# Altium schematic sheet LP_ECG_Power-X01.SchDoc: DB POWER (part 3 of 3)
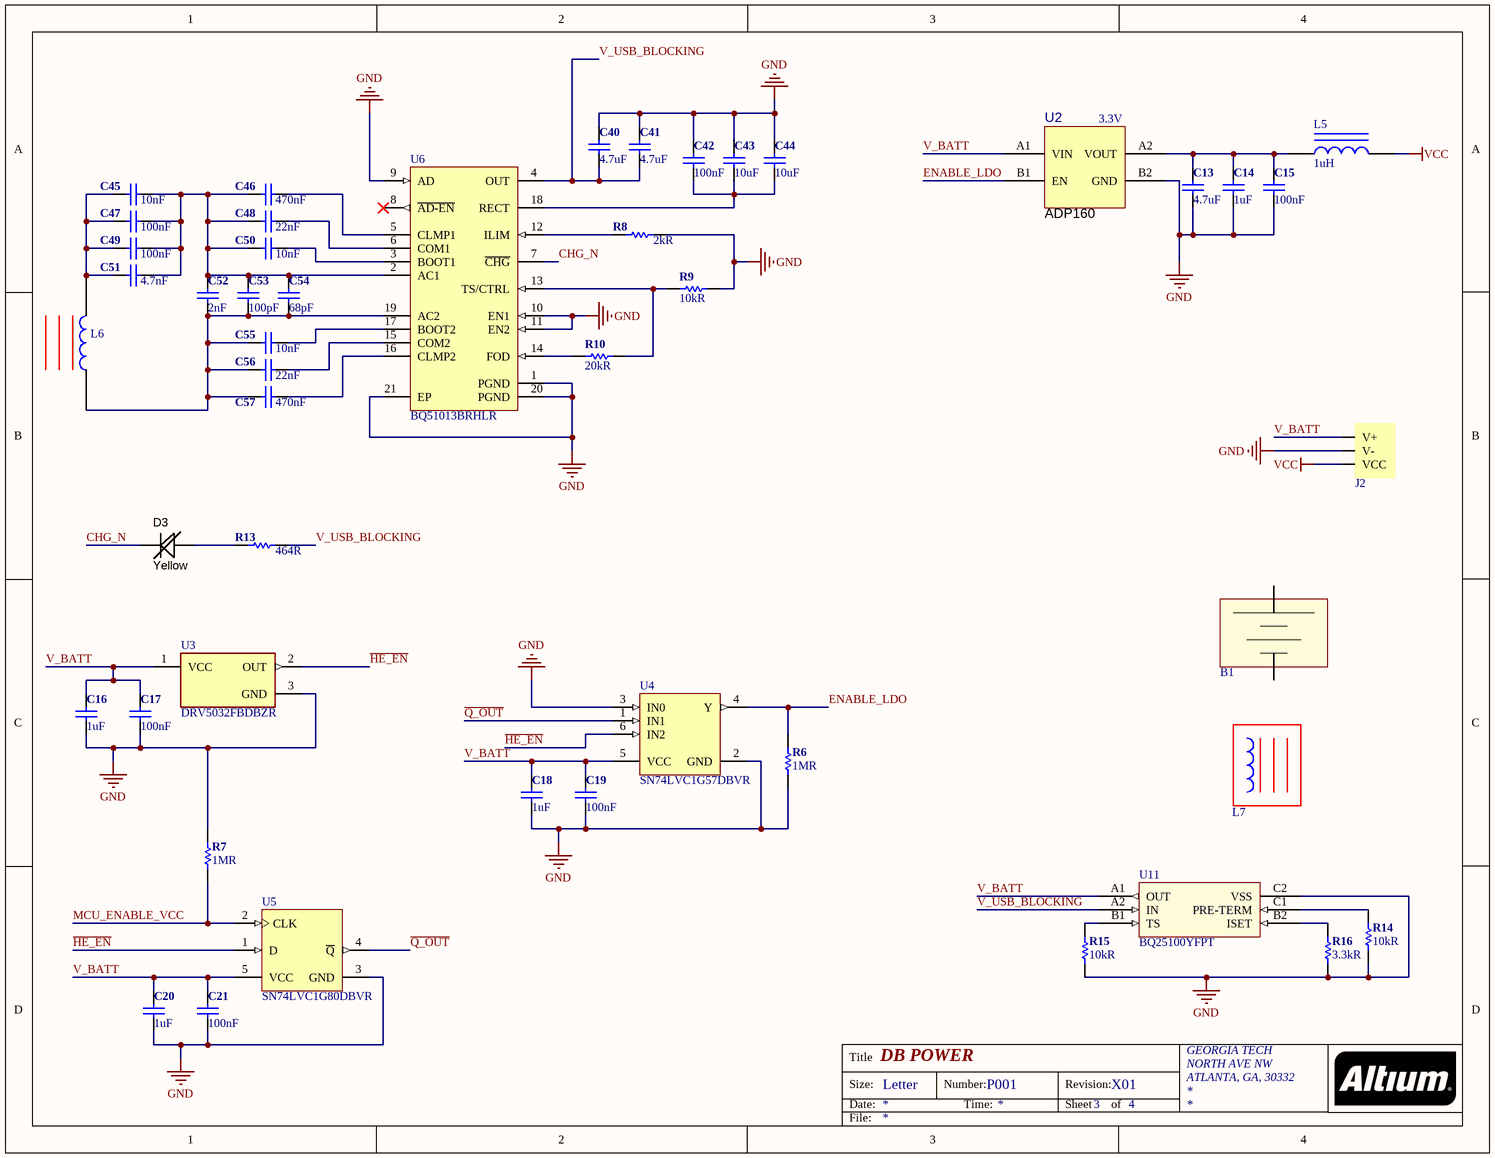
[diagram p2: LP_ECG_Power-X01.SchDoc]

## Library data of the parts (continued)
U4 = CMP-0859-00228-3: CONFIGURABLE MULTIPLE-FUNCTION GATE, DBV0006A, LARGE T&R; Manufacturer: Texas Instruments; Number of Inputs: 3; Min Supply Voltage: 1.65V; Max Supply Voltage: 5.5V; Propagation Delay: 6.3ns; Logic Function: NAND GATE,AND GATE,NOR GATE,OR GATE,Inverter,Multi Function; Number of Circuits: 1; High Level Output Current: -32mA; Low Level Output Current: 32mA; Number of Input Lines: 2; Quiescent Current: 10uA; Schmitt Trigger Input: Yes; Turn-On Delay Time: 6.1ns; Supplier 1: Digi-Key; Supplier Part Number 1: 296-15574-1-ND; Manufacturer Part Number: SN74LVC1G57DBVR; RoHS: Yes; Category: Logic Gates; Stock 1: 11185; Pricing 1: 1=0.37000, 10=0.28100, 25=0.25320, 100=0.17480, 250=0.14720, 500=0.11960, 1000=0.09200 (USD); Mount: Surface Mount; Case/Package: SOT-23; Number of Pins: 6; Weight: 0.000229oz; Contact Plating: Gold; Min Operating Temperature: -40°C; Max Operating Temperature: 125°C; Package Quantity: 3000; Packaging: Tape and Reel; Number of Gates: 1; Number of Output Lines: 1; Number of Elements: 1; Number of Bits: 1; Output Current: 32mA; Number of Outputs: 1; Max Output Current: 32mA; Termination: SMD/SMT; Length: 3.05mm; Height: 1.3mm; Width: 1.75mm; Radiation Hardening: No; Lead Free: Lead Free; REACH SVHC: No SVHC; ComponentLink1URL: https://www.ti.com:443/lit/ds/symlink/sn74lvc1g57.pdf?src-supplier=IHS+Markit; ComponentLink1Description: https://www.ti.com:443/lit/ds/symlink/sn74lvc1g57.pdf?src-supplier=IHS+Markit; ComponentLink2URL: https://datasheet.ciiva.com/15090/getdatasheetpartid-173082-15090973.pdf?src-supplier=Verical; ComponentLink2Description: https://datasheet.ciiva.com/15090/getdatasheetpartid-173082-15090973.pdf?src-supplier=Verical; ComponentLink3URL: https://datasheet.ciiva.com/1880/sn74lvc1g57-1880083.pdf?src-supplier=Digi-Key; ComponentLink3Description: https://datasheet.ciiva.com/1880/sn74lvc1g57-1880083.pdf?src-supplier=Digi-Key; ComponentLink4URL: https://datasheet.ciiva.com/1880/sn74lvc1g57-1880084.pdf?src-supplier=Digi-Key; ComponentLink4Description: https://datasheet.ciiva.com/1880/sn74lvc1g57-1880084.pdf?src-supplier=Digi-Key; ComponentLink5URL: https://datasheet.ciiva.com/46395/1882763-46395382.pdf?src-supplier=Element14; ComponentLink5Description: https://datasheet.ciiva.com/46395/1882763-46395382.pdf?src-supplier=Element14; ComponentLink6URL: https://datasheet.ciiva.com/46439/1834192-46439175.pdf?src-supplier=Element14; ComponentLink6Description: https://datasheet.ciiva.com/46439/1834192-46439175.pdf?src-supplier=Element14; ComponentLink7URL: https://datasheet.ciiva.com/7783/1771418-7783483.pdf?src-supplier=Element14; ComponentLink7Description: https://datasheet.ciiva.com/7783/1771418-7783483.pdf?src-supplier=Element14; ComponentLink8URL: https://datasheet.ciiva.com/7783/1771418-7783484.pdf?src-supplier=Element14; ComponentLink8Description: https://datasheet.ciiva.com/7783/1771418-7783484.pdf?src-supplier=Element14; ComponentLink9URL: https://datasheet.ciiva.com/1880/sn74lvc1g57-1880082.pdf?src-supplier=Digi-Key; ComponentLink9Description: https://datasheet.ciiva.com/1880/sn74lvc1g57-1880082.pdf?src-supplier=Digi-Key; ComponentLink10URL: https://datasheet.ciiva.com/48702/001075107-da-01-en-ic-mult-fun-sn74lvc1g57dbvr-sot-23-6-tid-48702374.pdf?src-supplier=Conrad; ComponentLink10Description: https://datasheet.ciiva.com/48702/001075107-da-01-en-ic-mult-fun-sn74lvc1g57dbvr-sot-23-6-tid-48702374.pdf?src-supplier=Conrad
U5 = CMP-0859-00176-3: Single Positive-Edge-Triggered D-Type Flip-Flop, DBV0005A, LARGE T&R; Manufacturer: Texas Instruments; Min Supply Voltage: 1.65V; Number of Elements: 1; Max Supply Voltage: 5.5V; Clock Edge Trigger Type: Positive Edge; Propagation Delay: 9.9ns; Frequency: 160MHz; Logic Function: D-Type,Flip-Flop; Turn-On Delay Time: 1.1ns; High Level Output Current: -32mA; Low Level Output Current: 32mA; Polarity: Inverting; Supplier 1: Digi-Key; Supplier Part Number 1: 296-9851-1-ND; Manufacturer Part Number: SN74LVC1G80DBVR; RoHS: Yes; Category: Latches and Flip Flops; Stock 1: 12348; Pricing 1: 1=0.32000, 10=0.24000, 25=0.21000, 100=0.13590, 250=0.11252, 500=0.09000, 1000=0.06900 (USD); Mount: Surface Mount; Case/Package: SOT-23; Number of Pins: 5; Weight: 0.000557oz; Min Operating Temperature: -40°C; Max Operating Temperature: 125°C; Packaging: Tape and Reel; Package Quantity: 3000; Number of Bits per Element: 1; Number of Input Lines: 1; Number of Output Lines: 1; Number of Circuits: 1; Number of Bits: 1; Number of Gates: 1; Output Current: 32mA; Max Frequency: 160MHz; Radiation Hardening: No; Lead Free: Lead Free; REACH SVHC: No SVHC; ComponentLink1URL: https://www.ti.com:443/lit/ds/symlink/sn74lvc1g80.pdf?src-supplier=IHS+Markit; ComponentLink1Description: https://www.ti.com:443/lit/ds/symlink/sn74lvc1g80.pdf?src-supplier=IHS+Markit; ComponentLink2URL: https://datasheet.ciiva.com/15091/getdatasheetpartid-71921-15091286.pdf?src-supplier=Verical; ComponentLink2Description: https://datasheet.ciiva.com/15091/getdatasheetpartid-71921-15091286.pdf?src-supplier=Verical; ComponentLink3URL: https://datasheet.ciiva.com/1854/sn74lvc1g80-1854761.pdf?src-supplier=Digi-Key; ComponentLink3Description: https://datasheet.ciiva.com/1854/sn74lvc1g80-1854761.pdf?src-supplier=Digi-Key; ComponentLink4URL: https://datasheet.ciiva.com/46395/1882705-46395835.pdf?src-supplier=Element14; ComponentLink4Description: https://datasheet.ciiva.com/46395/1882705-46395835.pdf?src-supplier=Element14; ComponentLink5URL: https://datasheet.ciiva.com/1854/sn74lvc1g80-1854762.pdf?src-supplier=Digi-Key; ComponentLink5Description: https://datasheet.ciiva.com/1854/sn74lvc1g80-1854762.pdf?src-supplier=Digi-Key; ComponentLink6URL: https://datasheet.ciiva.com/8055/1831218-8055610.pdf?src-supplier=Element14; ComponentLink6Description: https://datasheet.ciiva.com/8055/1831218-8055610.pdf?src-supplier=Element14; ComponentLink7URL: https://datasheet.ciiva.com/1854/sn74lvc1g80-1854763.pdf?src-supplier=Digi-Key; ComponentLink7Description: https://datasheet.ciiva.com/1854/sn74lvc1g80-1854763.pdf?src-supplier=Digi-Key
U6 = TI-BQ51013B-RHL20: WPC 1.1 Compatible Fully Integrated Wireless Power Receiver IC, 4 V Min Input, 20-pin VQFN (RHL), Green (RoHS & no Sb/Br); Manufacturer: Texas Instruments; Operating Supply Current: 8mA; Output Current: 1.5A; Output Voltage: 5V; Supplier 1: Digi-Key; Supplier Part Number 1: 296-38885-1-ND; Manufacturer Part Number: BQ51013BRHLR; RoHS: Yes; Category: Power Management ICs; Stock 1: 8882; Pricing 1: 1=3.33000, 10=2.97000, 25=2.67320, 100=2.43540, 250=2.19780, 500=1.97208, 1000=1.66320 (USD); Mount: Surface Mount; Case/Package: VQFN; Number of Pins: 20; Contact Plating: Gold; Min Operating Temperature: 0°C; Max Operating Temperature: 125°C; Packaging: Tape and Reel; Package Quantity: 3000; Logic Function: Receiver; Lead Free: Lead Free; ComponentLink1URL: https://www.ti.com:443/lit/ds/symlink/bq51013b.pdf?src-supplier=IHS+Markit; ComponentLink1Description: https://www.ti.com:443/lit/ds/symlink/bq51013b.pdf?src-supplier=IHS+Markit; ComponentLink2URL: https://datasheet.ciiva.com/6601/bq51013b-6601292.pdf?src-supplier=Digi-Key; ComponentLink2Description: https://datasheet.ciiva.com/6601/bq51013b-6601292.pdf?src-supplier=Digi-Key
U11 = BQ25100YFPT: Power Supply Support Circuit; Manufacturer: Texas Instruments; Output Voltage: 4.35V; Operating Supply Current: 75nA; Fault Protection: Over Voltage,Over Temperature,Short Circuit; Max Charge Current: 250mA; Battery Pack Voltage: 4.2V; Number of Cells: 1; Max Supply Voltage: 6.45V; Min Supply Voltage: 3.5V; Supplier 1: Digi-Key; Supplier Part Number 1: 296-38373-1-ND; Manufacturer Part Number: BQ25100YFPT; RoHS: Yes; Category: Batteries and Accessories; Stock 1: 3049; Pricing 1: 1=2.24000, 10=2.01100, 25=1.89760, 100=1.51800 (USD); Mount: Surface Mount; Number of Pins: 6; Weight: 6E-05oz; Contact Plating: Copper,Tin,Silver; Min Operating Temperature: -40°C; Max Operating Temperature: 85°C; Package Quantity: 250; Packaging: Tape and Reel; Output Current: 250mA; Lead Free: Lead Free; REACH SVHC: No SVHC; ComponentLink1URL: https://www.ti.com:443/lit/ds/symlink/bq25100.pdf?src-supplier=IHS+Markit; ComponentLink1Description: https://www.ti.com:443/lit/ds/symlink/bq25100.pdf?src-supplier=IHS+Markit; ComponentLink2URL: https://datasheet.ciiva.com/46404/1854517-46404758.pdf?src-supplier=Element14; ComponentLink2Description: https://datasheet.ciiva.com/46404/1854517-46404758.pdf?src-supplier=Element14